# Altium schematic sheet Sheet1.SchDoc
size A4
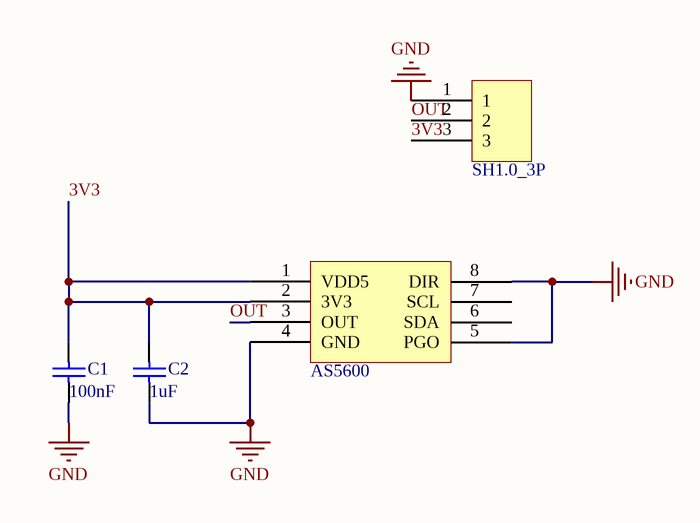
[diagram p0: Sheet1.SchDoc]

## Parts
*  AS5600  [SOP8]
?  SH1.0_3P  [SH1_3P]
C1  value 100nF  [1608[0603]]  (hidden comment: Cap Semi)
C2  value 1uF  [1608[0603]]  (hidden comment: Cap Semi)

## Nets
GND: *.4(GND) *.5(PGO) *.8(DIR) ?.1 C1.1 C2.1
3V3: *.1(VDD5) *.2(3V3) ?.3 C1.2 C2.2
OUT: *.3(OUT) ?.2

Not connected (* = marked no-connect by the designer): * 6(SDA) 7(SCL)

## Library data of the parts
C1 C2 = Cap Semi: Capacitor (Semiconductor SIM Model); Published: 8-Jun-2000; LatestRevisionDate: 29-May-2009; LatestRevisionNote: IPC-7351 Footprint Added.; PackageReference: C1206; Publisher: Altium Limited; PackageDescription: Chip Capacitor